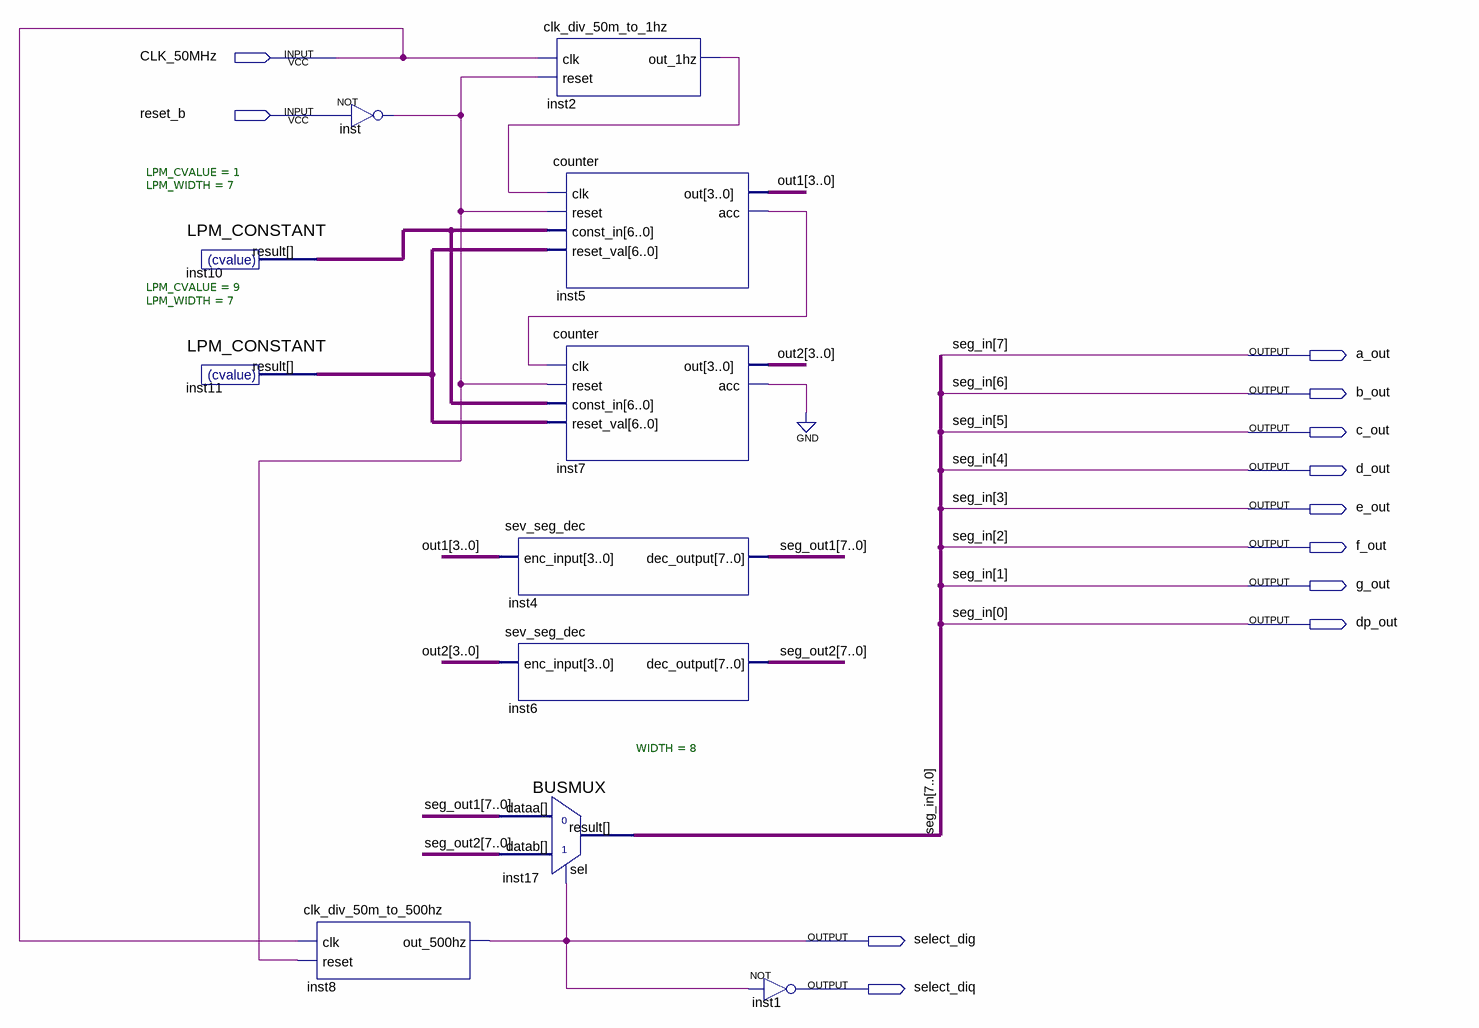
[diagram p0: schematic sheet]
// Quartus schematic practice3.bdf as structural Verilog: 11 symbols, 12 pins
module practice3 (
  input  CLK_50MHz,
  input  reset_b,
  output a_out,
  output b_out,
  output c_out,
  output d_out,
  output e_out,
  output f_out,
  output g_out,
  output dp_out,
  output select_dig,
  output select_diq
);

  wire inst2_out_1hz, inst5_acc, inst7_acc, inst_out;
  wire [3:0] out1, out2;
  wire [6:0] inst10_result, inst11_result;
  wire [7:0] seg_out1, seg_out2;

  LPM_CONSTANT #(.LPM_CVALUE(1), .LPM_WIDTH(7)) inst10 (.result(inst10_result));
  LPM_CONSTANT #(.LPM_CVALUE(9), .LPM_WIDTH(7)) inst11 (.result(inst11_result));
  not inst (inst_out, reset_b);
  clk_div_50m_to_500hz inst8 (.clk(CLK_50MHz), .reset(inst_out), .out_500hz(select_dig));
  clk_div_50m_to_1hz inst2 (.clk(CLK_50MHz), .reset(inst_out), .out_1hz(inst2_out_1hz));
  counter inst5 (
    .clk(inst2_out_1hz), .reset(inst_out), .const_in(inst10_result), .reset_val(inst11_result), .out(out1),
    .acc(inst5_acc));
  counter inst7 (
    .clk(inst5_acc), .reset(inst_out), .const_in(inst10_result), .reset_val(inst11_result), .out(out2),
    .acc(inst7_acc));
  sev_seg_dec inst4 (.enc_input(out1), .dec_output(seg_out1));
  sev_seg_dec inst6 (.enc_input(out2), .dec_output(seg_out2));
  BUSMUX #(.WIDTH(8)) inst17 (
    .datab(seg_out2), .sel(select_dig), .dataa(seg_out1),
    .result({a_out, b_out, c_out, d_out, e_out, f_out, g_out, dp_out}));
  not inst1 (select_diq, select_dig);
  // also tied to GND on the sheet: inst7_acc

  // Other names for the same wires on the sheet: seg_in[7:0] = {a_out, b_out, c_out, d_out, e_out, f_out, g_out, dp_out}
endmodule
